# EAGLE schematic COM_Board (EAGLE 7.7.0)
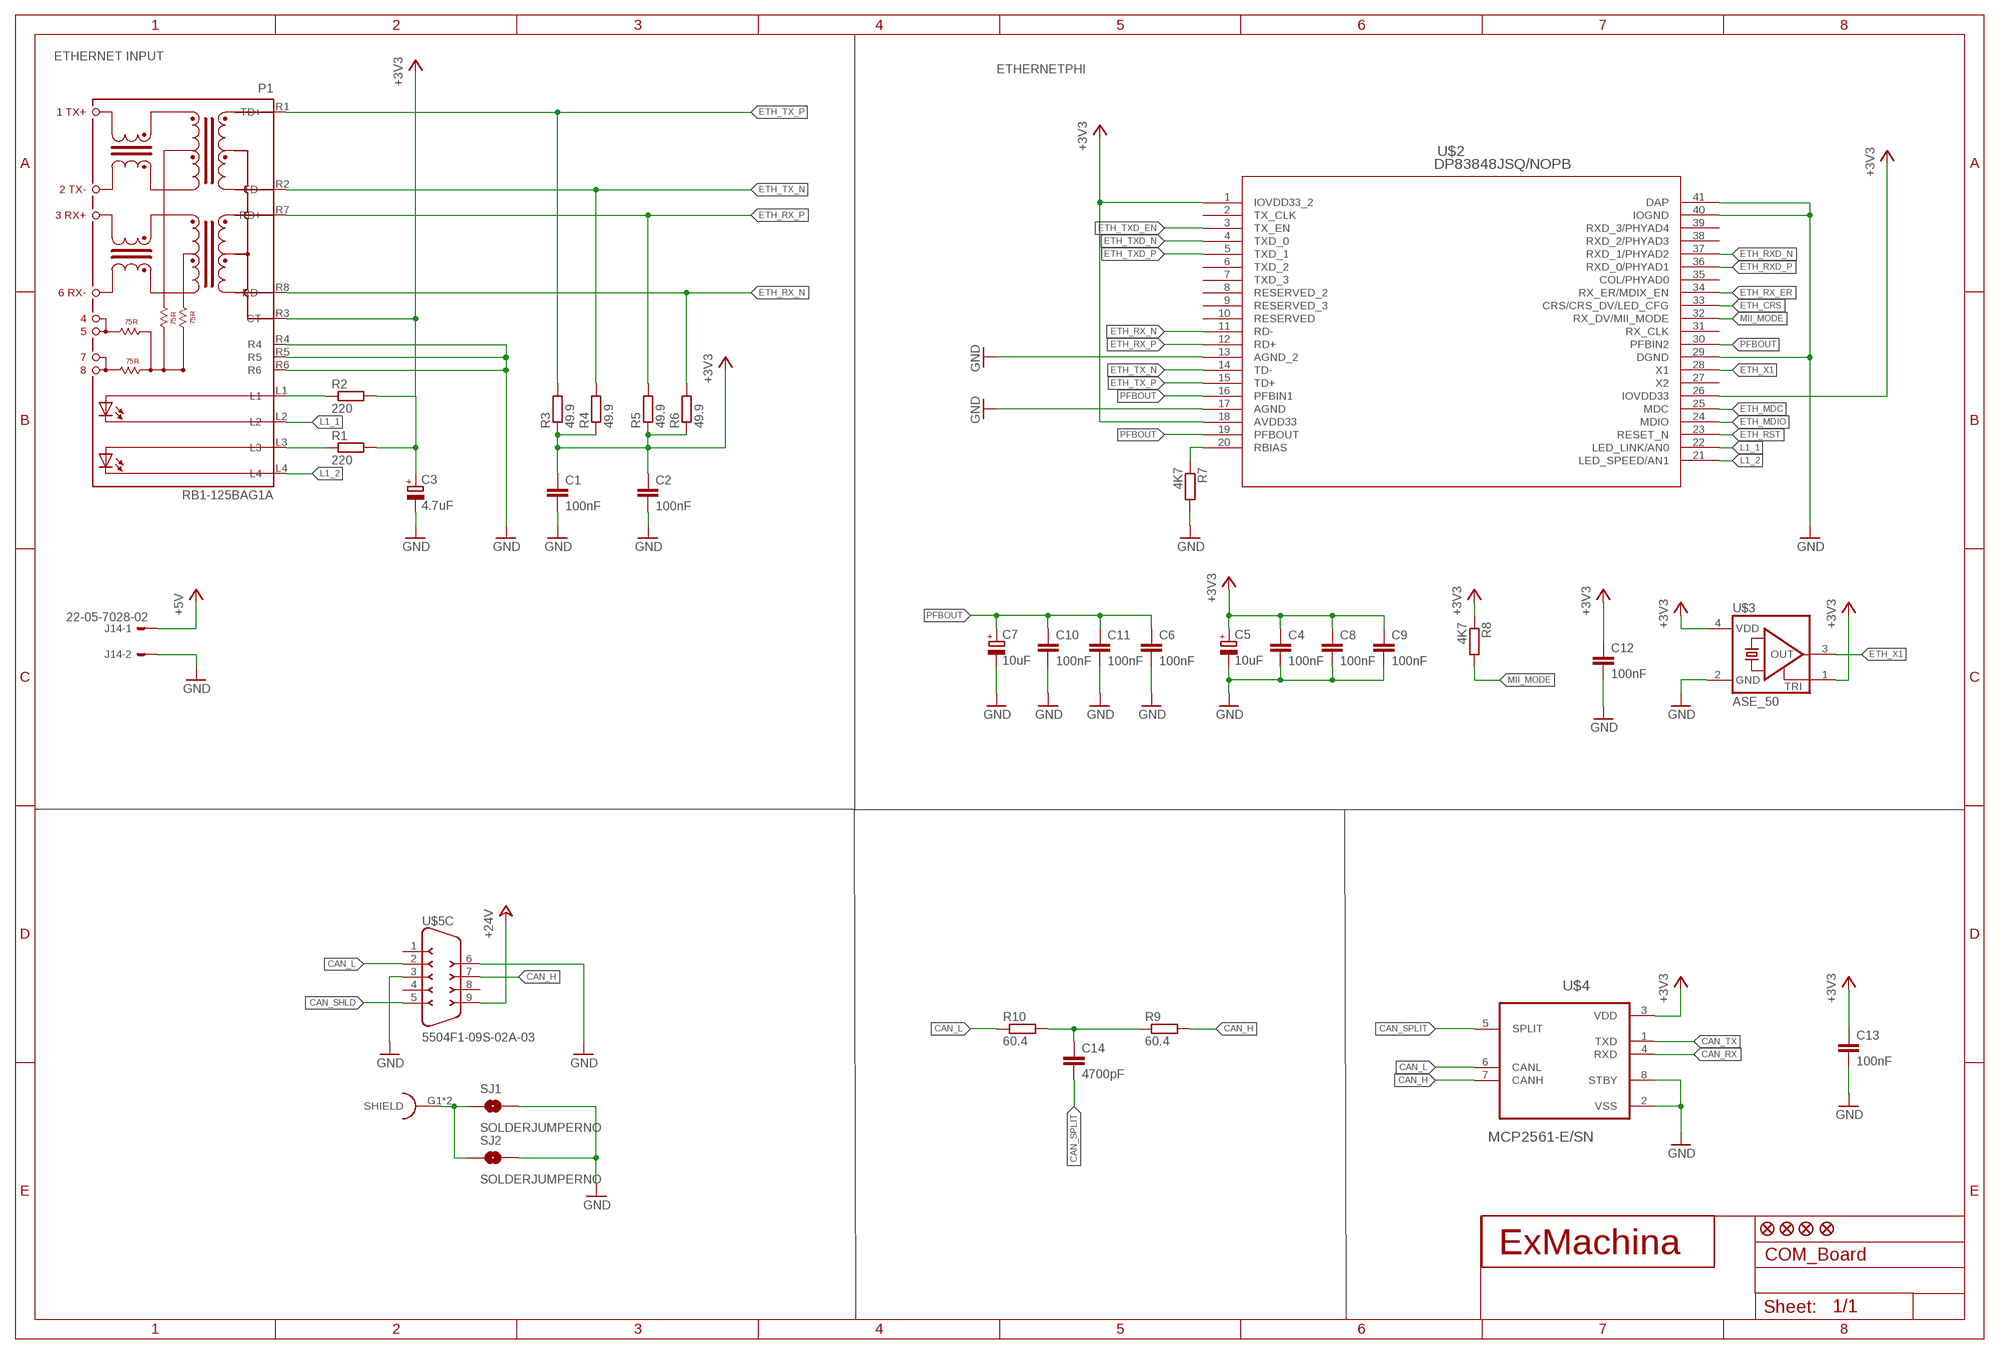
[diagram p0: schematic, sheet 1]

## Parts
C1  100nF  C-EUC0603  [C0603]
C2  100nF  C-EUC0603  [C0603]
C3  4.7uF  CPOL-EUCT3216  [CT3216]
C4  100nF  C-EUC0603  [C0603]
C5  10uF  CPOL-EUCT3216  [CT3216]
C6  100nF  C-EUC0603  [C0603]
C7  10uF  CPOL-EUCT3216  [CT3216]
C8  100nF  C-EUC0603  [C0603]
C9  100nF  C-EUC0603  [C0603]
C10  100nF  C-EUC0603  [C0603]
C11  100nF  C-EUC0603  [C0603]
C12  100nF  C-EUC0603  [C0603]
C13  100nF  C-EUC0603  [C0603]
C14  4700pF  C-EUC0603  [C0603]
J14  22-05-7028-02  [7395-02]
JP2  FIDUCIAL1X2  [FIDUCIAL-1X2]
JP3  FIDUCIAL1X2  [FIDUCIAL-1X2]
JP4  FIDUCIAL1X2  [FIDUCIAL-1X2]
JP5  FIDUCIAL1X2  [FIDUCIAL-1X2]
P1  RB1-125BAG1A  [WIZNET_RB1-125BAG1A]
R1  220  R-EU_R0603  [R0603]
R2  220  R-EU_R0603  [R0603]
R3  49.9  R-EU_R0603  [R0603]
R4  49.9  R-EU_R0603  [R0603]
R5  49.9  R-EU_R0603  [R0603]
R6  49.9  R-EU_R0603  [R0603]
R7  4K7  R-EU_R0603  [R0603]
R8  4K7  R-EU_R0603  [R0603]
R9  60.4  R-EU_R0603  [R0603]
R10  60.4  R-EU_R0603  [R0603]
SJ1  SOLDERJUMPERNO  [SJ_2S-NO]
SJ2  SOLDERJUMPERNO  [SJ_2S-NO]
U$1  EXMACHINA-LOGO-NAME  [EXM-LOGO-BASELINE]
U$2  DP83848JSQ/NOPB  [SQA40B]
U$3  ASE_50  ASE  [ASE]
U$4  MCP2561-E/SN  [SOIC127P600X175-8N]
U$5  5504F1-09S-02A-03  [5504F1-09S-02A]

## Nets
+3V3 [supply]: C1.1 C2.1 C3.+ C4.1 C5.+ C8.1 C9.1 C12.1 C13.1 P1.R3(CT) R1.2 R2.2 R3.1 R4.1 R5.1 R6.1 R8.1 U$2.1(IOVDD33_2) U$2.18(AVDD33) U$2.26(IOVDD33) U$3.1(TRI) U$3.4(VDD) U$4.3(VDD)
+5V [supply]: J14.1
+24V: U$5.9
CAN_H [signal]: R9.2 U$4.7(CANH) U$5.7
CAN_L [signal]: R10.1 U$4.6(CANL) U$5.2
CAN_RX [signal]: U$4.4(RXD)
CAN_SHLD: U$5.5
CAN_SPLIT [signal]: C14.2 U$4.5(SPLIT)
CAN_TX [signal]: U$4.1(TXD)
ETH_CRS [signal]: U$2.33(CRS/CRS_DV/LED_CFG)
ETH_MDC [signal]: U$2.25(MDC)
ETH_MDIO [signal]: U$2.24(MDIO)
ETH_RST [signal]: U$2.23(RESET_N)
ETH_RX_ER [signal]: U$2.34(RX_ER/MDIX_EN)
ETH_RX_N [signal]: P1.R8(RD-) R6.2 U$2.11(RD-)
ETH_RX_P [signal]: P1.R7(RD+) R5.2 U$2.12(RD+)
ETH_RXD_N [signal]: U$2.37(RXD_1/PHYAD2)
ETH_RXD_P [signal]: U$2.36(RXD_0/PHYAD1)
ETH_TX_N [signal]: P1.R2(TD-) R4.2 U$2.14(TD-)
ETH_TX_P [signal]: P1.R1(TD+) R3.2 U$2.15(TD+)
ETH_TXD_EN [signal]: U$2.3(TX_EN)
ETH_TXD_N [signal]: U$2.4(TXD_0)
ETH_TXD_P [signal]: U$2.5(TXD_1)
ETH_X1 [signal]: U$2.28(X1) U$3.3(OUT)
GND [supply]: C1.2 C2.2 C3.- C4.2 C5.- C6.2 C7.- C8.2 C9.2 C10.2 C11.2 C12.2 C13.2 J14.2 P1.R4 P1.R5 P1.R6 R7.2 SJ1.2 SJ2.2 U$2.13(AGND_2) U$2.17(AGND) U$2.29(DGND) U$2.40(IOGND) U$2.41(DAP) U$3.2(GND) U$4.2(VSS) U$4.8(STBY) U$5.3 U$5.6
L1_1 [signal]: P1.L2 U$2.22(LED_LINK/AN0)
L1_2 [signal]: P1.L4 U$2.21(LED_SPEED/AN1)
MII_MODE [signal]: R8.2 U$2.32(RX_DV/MII_MODE)
N$3: C14.1 R9.1 R10.2
N$4: R7.1 U$2.20(RBIAS)
N$6: SJ1.1 SJ2.1 U$5.G1(S:SHIELD) U$5.G2(S:SHIELD)
N$8 [signal]: P1.L1 R2.1
N$9 [signal]: P1.L3 R1.1
PFBOUT [signal]: C6.1 C7.+ C10.1 C11.1 U$2.16(PFBIN1) U$2.19(PFBOUT) U$2.30(PFBIN2)
Unconnected: U$2.2(TX_CLK) U$2.6(TXD_2) U$2.7(TXD_3) U$2.8(RESERVED_2) U$2.9(RESERVED_3) U$2.10(RESERVED) U$2.27(X2) U$2.31(RX_CLK) U$2.35(COL/PHYAD0) U$2.38(RXD_2/PHYAD3) U$2.39(RXD_3/PHYAD4) U$5.1 U$5.4 U$5.8

## Notes on the sheet
- ETHERNET INPUT
- ETHERNETPHI

## Library data of the parts
C1 C2 C4 C6 C8-C14 = rcl:C-EU: CAPACITOR, European symbol
C3 C5 C7 = rcl:CPOL-EU: POLARIZED CAPACITOR, European symbol
J14 = con-molex:22-?-02: CONNECTOR wire to board 2.54 mm (.1 inch) pitch header; OC_FARNELL: 9731601; OC_NEWARK: unknown
JP2-JP5 = SparkFun:FIDUCIAL: Fiducial Alignment Points Various fiducial points for machine vision alignment.
P1 = con-wiznet:RB1-125BAG1A: Accessory RJ-45 With Transformer Connector - UDE
R1-R10 = rcl:R-EU_: RESISTOR, European symbol
SJ1 SJ2 = SparkFun-Passives:SOLDERJUMPER: Solder Jumper Standard SMD solder jumper. Used to automate production. Two varients : Normally Open and Normally Closed are the same, but have different paste layers. NC will have a large amount of paste and should jumper during reflow.
U$1 = exmachina:EXMACHINA-LOGO
U$2 = texas:DP83848JSQ/NOPB; COPYRIGHT: Copyright (C) 2015 Accelerated Designs. All rights reserved; MANUFACTURER_PART_NUMBER: dp83848jsqnopb; VENDOR: National Semiconductor
U$3 = crystal:ASE: 3.3Vdc CMOS SMD CRYSTAL CLOCK OSCILLATOR SOurce: www.abracon.com; OC_FARNELL: unknown; OC_NEWARK: unknown
U$4 = Microchip_By_element14_Batch_1:MCP2561-E/SN: High-Speed CAN Transceiver; MPN: MCP2551-I/SN; PACKAGE: SOIC-8; SUPPLIER: Microchip
U$5 = con-multicomp:5504F1-09S-02A-03: D-Sub 9pts, Righ-angle, solder

## Net classes
1 signal: width 0.178 mm, drill 0.35 mm
2 supply: width 0.008 mm, drill 0.5 mm